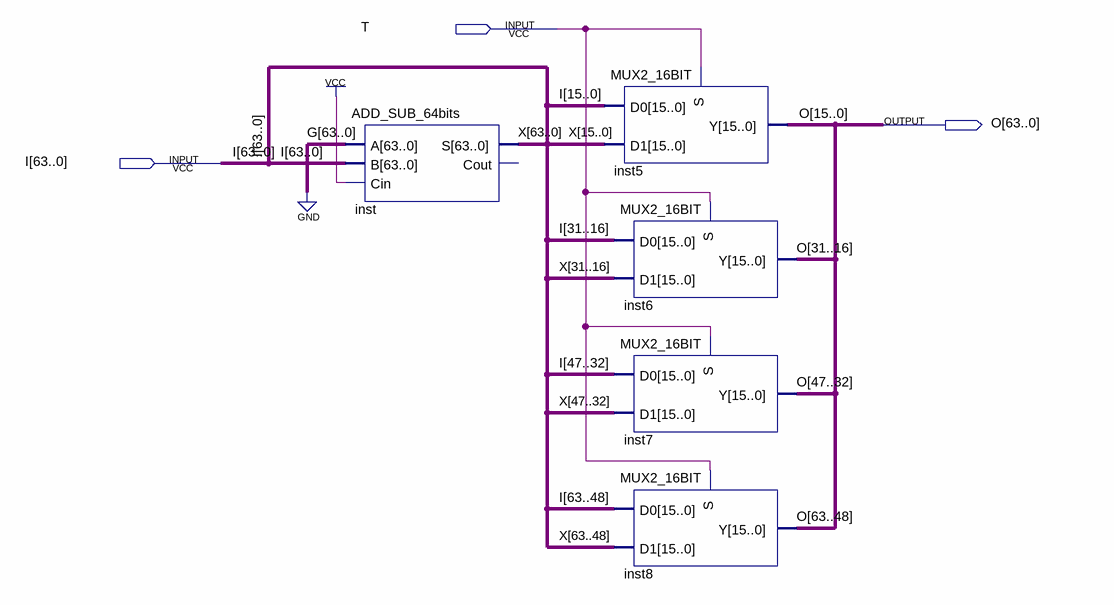
[diagram p0: schematic sheet]
// Quartus schematic trans_64bits.bdf as structural Verilog: 5 symbols, 3 pins
module trans_64bits (
  input  T,
  input  [63:0] I,
  output [63:0] O
);

  wire [63:0] X;

  ADD_SUB_64bits inst (.A({64{1'b0}}), .B(I), .Cin(1'b1), .S(X));  // open: Cout
  MUX2_16BIT inst5 (.S(T), .D1(X[15:0]), .D0(I[15:0]), .Y(O[15:0]));
  MUX2_16BIT inst6 (.S(T), .D1(X[31:16]), .D0(I[31:16]), .Y(O[31:16]));
  MUX2_16BIT inst7 (.S(T), .D1(X[47:32]), .D0(I[47:32]), .Y(O[47:32]));
  MUX2_16BIT inst8 (.S(T), .D1(X[63:48]), .D0(I[63:48]), .Y(O[63:48]));
endmodule
